# EAGLE design mokkamaster (EAGLE 8.7.0)
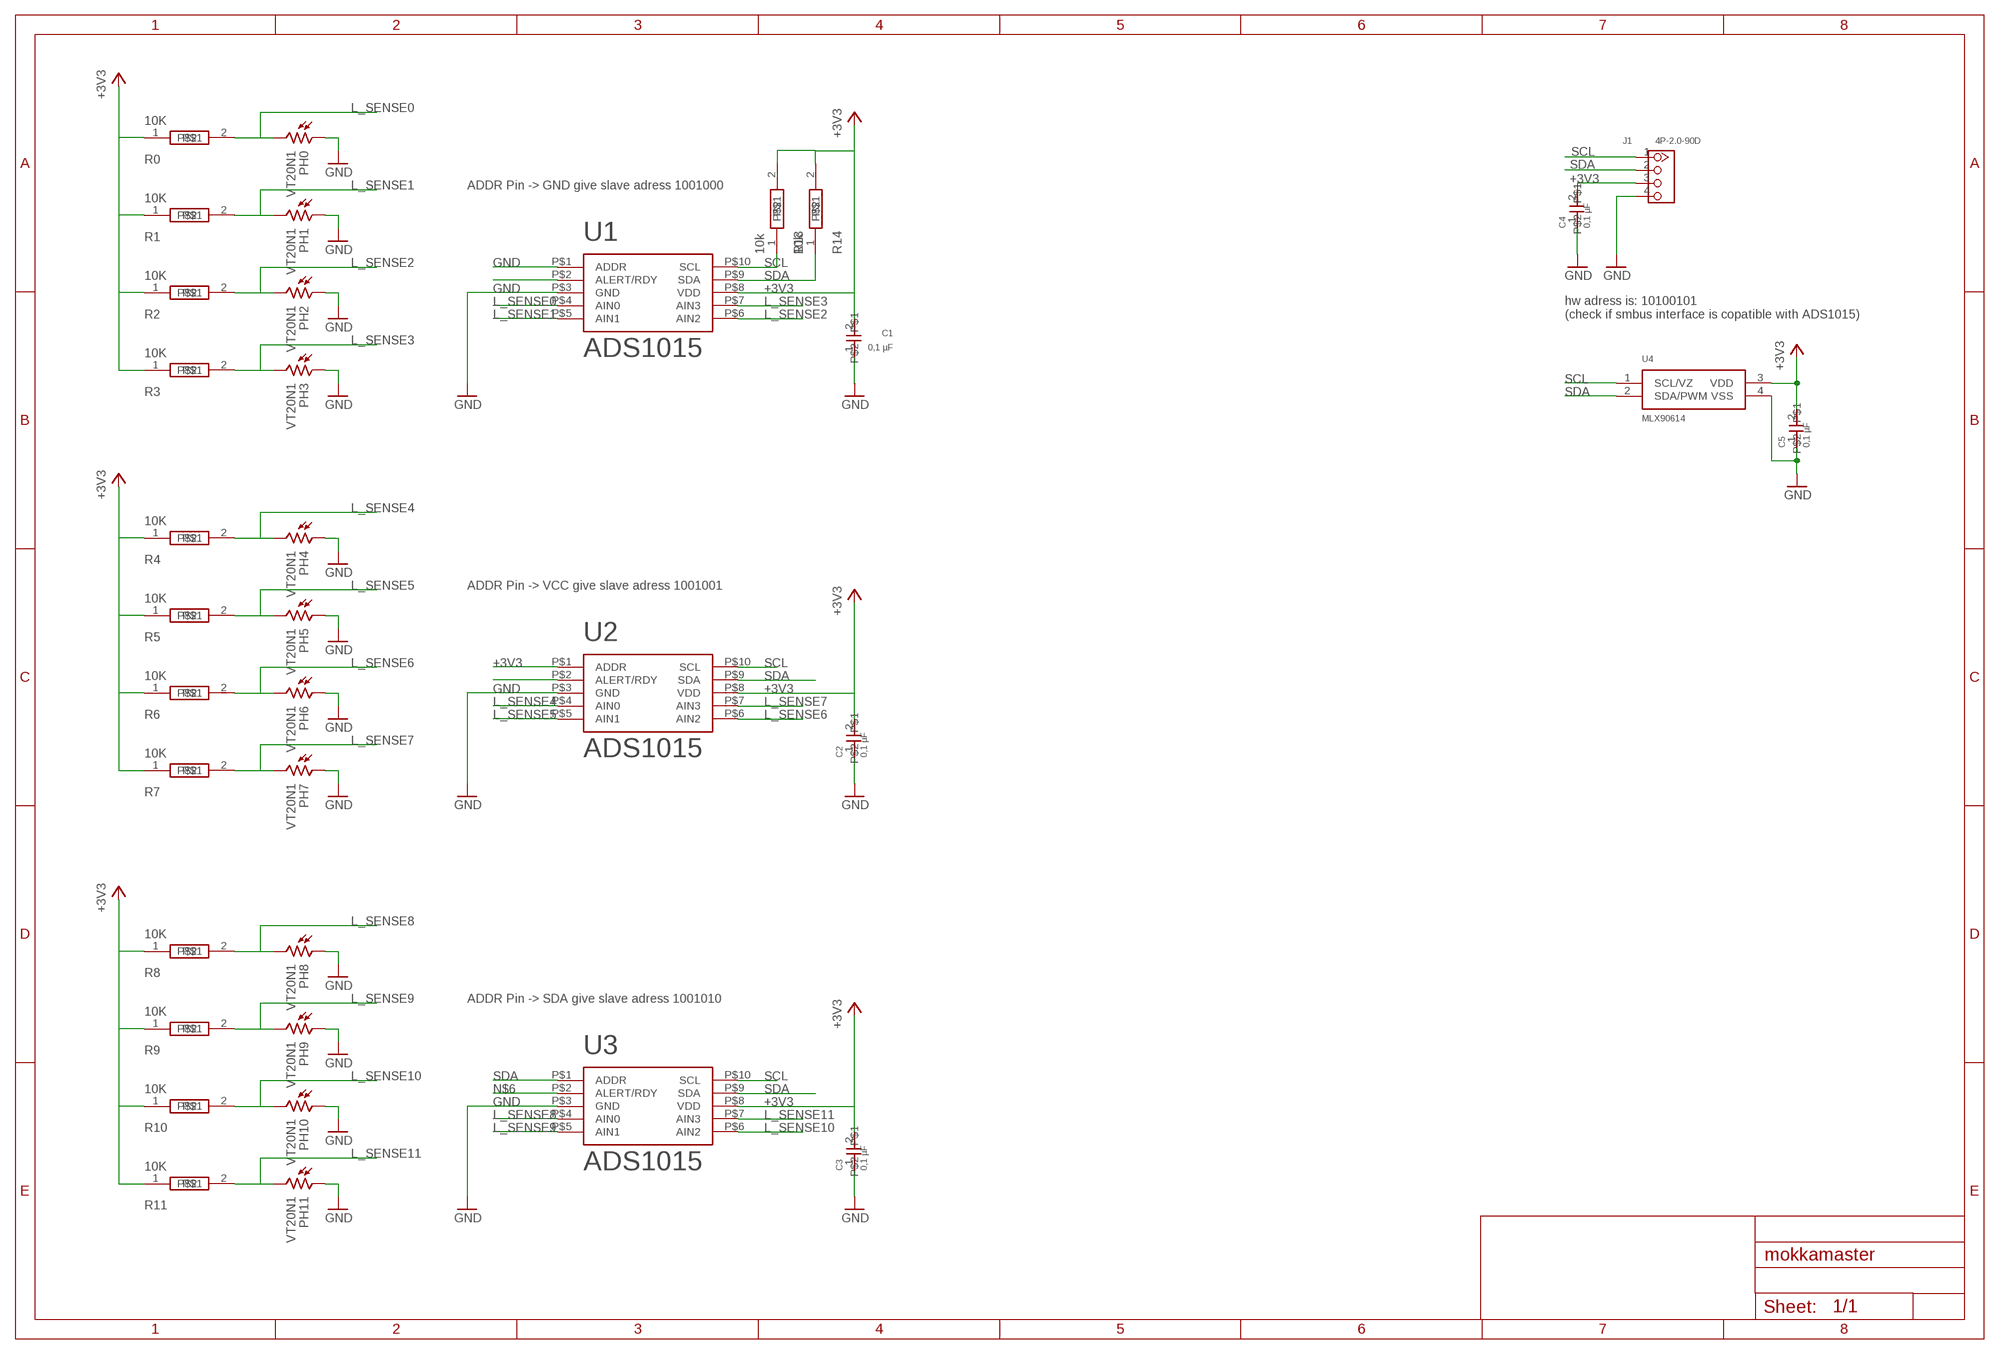
[diagram p0: schematic, sheet 1]

## Parts
C1  0,1 µF  CAPACITOR_GENERIC  [C0603]
C2  0,1 µF  CAPACITOR_GENERIC  [C0603]
C3  0,1 µF  CAPACITOR_GENERIC  [C0603]
C4  0,1 µF  CAPACITOR_GENERIC  [C0603]
C5  0,1 µF  CAPACITOR_GENERIC  [C0603]
J1  4P-2.0-90D  GROVE-CONNECTOR-DIP-90D(4P-2.0)  [HW4-2.0-90D]
PH0  VT20N1  [TO46-VT200]
PH1  VT20N1  [TO46-VT200]
PH2  VT20N1  [TO46-VT200]
PH3  VT20N1  [TO46-VT200]
PH4  VT20N1  [TO46-VT200]
PH5  VT20N1  [TO46-VT200]
PH6  VT20N1  [TO46-VT200]
PH7  VT20N1  [TO46-VT200]
PH8  VT20N1  [TO46-VT200]
PH9  VT20N1  [TO46-VT200]
PH10  VT20N1  [TO46-VT200]
PH11  VT20N1  [TO46-VT200]
R0  10K  RESISTOR_GENERIC  [R0603]
R1  10K  RESISTOR_GENERIC  [R0603]
R2  10K  RESISTOR_GENERIC  [R0603]
R3  10K  RESISTOR_GENERIC  [R0603]
R4  10K  RESISTOR_GENERIC  [R0603]
R5  10K  RESISTOR_GENERIC  [R0603]
R6  10K  RESISTOR_GENERIC  [R0603]
R7  10K  RESISTOR_GENERIC  [R0603]
R8  10K  RESISTOR_GENERIC  [R0603]
R9  10K  RESISTOR_GENERIC  [R0603]
R10  10K  RESISTOR_GENERIC  [R0603]
R11  10K  RESISTOR_GENERIC  [R0603]
R13  10k  RESISTOR_GENERIC  [R0603]
R14  10k  RESISTOR_GENERIC  [R0603]
U1  ADS1015  [PDSO-G10]
U2  ADS1015  [PDSO-G10]
U3  ADS1015  [PDSO-G10]
U4  MLX90614  [SPARKFUN_TO-39]

## Nets
+3V3: C1.2 C2.2 C3.2 C4.2 C5.2 J1.3 R0.1 R1.1 R2.1 R3.1 R4.1 R5.1 R6.1 R7.1 R8.1 R9.1 R10.1 R11.1 R13.2 R14.2 U1.P$8(VDD) U2.P$1(ADDR) U2.P$8(VDD) U3.P$8(VDD) U4.3(VDD)
GND: C1.1 C2.1 C3.1 C4.1 C5.1 J1.4 PH0.1 PH1.1 PH2.1 PH3.1 PH4.1 PH5.1 PH6.1 PH7.1 PH8.1 PH9.1 PH10.1 PH11.1 U1.P$1(ADDR) U1.P$3(GND) U2.P$3(GND) U3.P$3(GND) U4.4(VSS)
L_SENSE0: PH0.2 R0.2 U1.P$4(AIN0)
L_SENSE1: PH1.2 R1.2 U1.P$5(AIN1)
L_SENSE2: PH2.2 R2.2 U1.P$6(AIN2)
L_SENSE3: PH3.2 R3.2 U1.P$7(AIN3)
L_SENSE4: PH4.2 R4.2 U2.P$4(AIN0)
L_SENSE5: PH5.2 R5.2 U2.P$5(AIN1)
L_SENSE6: PH6.2 R6.2 U2.P$6(AIN2)
L_SENSE7: PH7.2 R7.2 U2.P$7(AIN3)
L_SENSE8: PH8.2 R8.2 U3.P$4(AIN0)
L_SENSE9: PH9.2 R9.2 U3.P$5(AIN1)
L_SENSE10: PH10.2 R10.2 U3.P$6(AIN2)
L_SENSE11: PH11.2 R11.2 U3.P$7(AIN3)
N$3: U2.P$2(ALERT/RDY)
N$6: U3.P$2(ALERT/RDY)
N$13: U1.P$2(ALERT/RDY)
SCL: J1.1 R13.1 U1.P$10(SCL) U2.P$10(SCL) U3.P$10(SCL) U4.1(SCL/VZ)
SDA: J1.2 R14.1 U1.P$9(SDA) U2.P$9(SDA) U3.P$1(ADDR) U3.P$9(SDA) U4.2(SDA/PWM)

## Notes on the sheet
- ADDR Pin -> GND give slave adress 1001000
- hw adress is: 10100101
  (check if smbus interface is copatible with ADS1015)
- ADDR Pin -> VCC give slave adress 1001001
- ADDR Pin -> SDA give slave adress 1001010

## Library data of the parts
C1-C5 = commons:CAPACITOR_GENERIC
J1 = Seeed-Connector:GROVE-CONNECTOR-DIP-90D(4P-2.0): 320110034; SPICEPREFIX: X
PH0 PH1-PH11 = commons:VT2*: Photoconductive Cell VT200 Series Source: http://optoelectronics.perkinelmer.com/content/Datasheets/DTS_vt200seriesdatasheet.pdf
R0 R1-R11 R13 R14 = commons:RESISTOR_GENERIC: generic smd resistors
U1-U3 = commons:ADS1015: TI ADS1015 NOT TESTED !! ADS101x Ultra-Small, Low-Power, I 2 C-Compatible, 3.3-kSPS, 12-Bit ADCs With Internal Reference, Oscillator, and Programmable Comparator
U4 = MLX90614:MLX90614

## Board
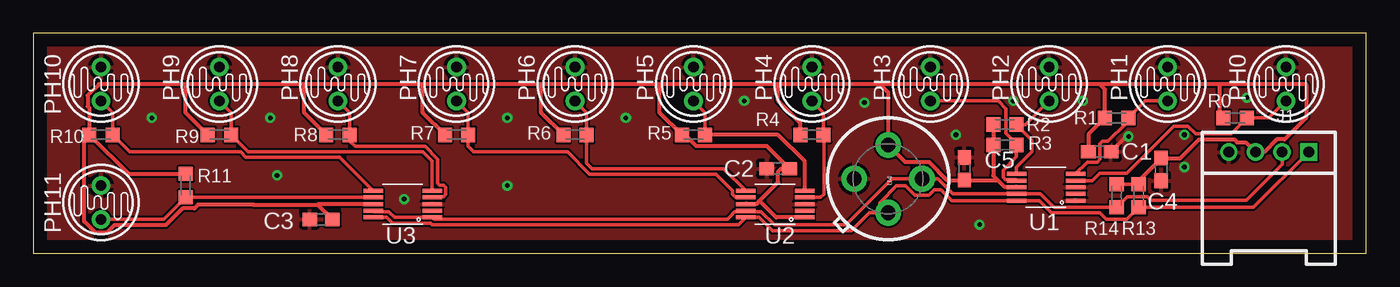
[diagram p1: board, top side]
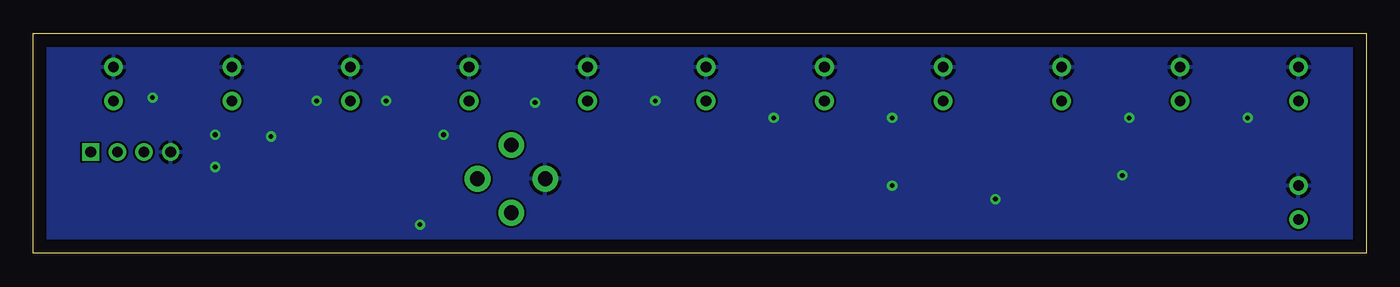
[diagram p2: board, bottom side, seen from below]

Size 100 x 16.5 mm. Coordinates in mm from the lower left corner, seen from the top.
Outline: 0,0 100,0 100,16.5 0,16.5 0,0
Copper layers (1*16): Top 0.035mm / dielectric 1.5mm / Bottom 0.035mm
Design rules "default": minimum track width 6mil, minimum drill 0.35mm, track to track 6mil, track to pad 6mil, pad to pad 6mil, via to via 6mil, smd to smd 6mil, copper to edge 40mil, drill to drill 6mil, minimum pad ring 10mil, minimum via ring 8mil, stop-mask expansion 4mil, vias tented up to drill 0mil, thermal gap 10mil

### Footprints (pad centres in the part's own frame; a part is rotated, then mirrored left to right if it is on the bottom)
C0603 = smd 1.1 x 1: 1 -0.85,0; 2 0.85,0
HW4-2.0-90D = drill 0.8 pad 1.27 square: 1 -3,0 | drill 0.8 pad 1.27: 2 -1,0; 3 1,0; 4 3,0
TO46-VT200 = drill 0.8 pad 1.4: 1 -1.27,0; 2 1.27,0
R0603 = smd 1.05 x 1.08: 1 -0.875,0; 2 0.875,0
PDSO-G10 = smd 0.3 x 1.45: P$1 0.15,-0.727; P$2 0.65,-0.727; P$3 1.15,-0.727; P$4 1.65,-0.727; P$5 2.15,-0.727; P$6 2.15,3.698; P$7 1.65,3.698; P$8 1.15,3.698; P$9 0.65,3.698; P$10 0.15,3.698
SPARKFUN_TO-39 = drill 1.1 pad 1.93: 1 2.54,0; 2 0,2.54; 3 -2.54,0; 4 0,-2.54

### Placement (x,y rotation side)
C1  80.01,7.62 180 top
C2  55.88,6.35 0 top
C3  21.59,2.54 0 top
C4  84.62,6.3 90 top
C5  69.85,6.35 270 top
J1  92.69,7.59 180 top
PH0  93.98,12.7 270 top
PH1  85.09,12.7 270 top
PH2  76.2,12.7 270 top
PH3  67.31,12.7 270 top
PH4  58.42,12.7 270 top
PH5  49.53,12.7 270 top
PH6  40.64,12.7 270 top
PH7  31.75,12.7 270 top
PH8  22.86,12.7 270 top
PH9  13.97,12.7 270 top
PH10  5.08,12.7 270 top
PH11  5.08,3.81 270 top
R0  90.17,10.16 0 top
R1  81.28,10.16 0 top
R2  72.9,9.65 0 top
R3  72.9,8.13 0 top
R4  58.42,8.89 0 top
R5  49.53,8.89 0 top
R6  40.64,8.89 0 top
R7  31.75,8.89 0 top
R8  22.86,8.89 0 top
R9  13.97,8.89 0 top
R10  5.08,8.89 0 top
R11  11.43,5.08 270 top
R13  82.93,4.32 90 top
R14  81.28,4.32 90 top
U1  77.47,3.81 90 top
U2  57.15,2.54 90 top
U3  29.21,2.54 90 top
U4  64.14,5.59 270 top

### Tracks (layer width: path | path; a pad name or v marks a point on that pad's centre or on a via)
+3V3
  Top 0.254: 16.51,3.65 16.68,3.65 | R14.2 R13.2
  Top 0.305: R10.1 7.14,5.96 R11.1 | U2.P$8 53.5,3.73 54.3,3.73 54.49,3.93 | 54.49,3.93 55.88,5.32 55.88,6.12 56.11,6.35 C2.2 55.03,8.04 49.75,8.04 48.91,8.89 R5.1 46.99,10.55 46.99,12.7 | 89,12.7 95.5,12.7 95.5,10.16 93.89,8.55 93.3,8.55 92.34,7.59 J1.3 90.96,8.32 90.32,8.32 90.09,8.55 87.46,8.55 86.06,7.15 C4.2 82.93,5.46 R13.2 | 89,12.7 80.01,12.7 | 80.01,12.7 63.5,12.7 | 63.5,12.7 55.88,12.7 | 55.88,12.7 46.99,12.7 | 46.99,12.7 38.1,12.7 | 38.1,12.7 29.21,12.7 | 29.21,12.7 20.32,12.7 | 20.32,12.7 11.43,12.7 | 80.01,12.7 80.41,12.3 R1.1 79.16,8.91 C1.2 | R4.1 57.55,9.77 55.88,11.43 55.88,12.7 | R6.1 38.1,10.55 38.1,12.7 | R7.1 29.21,10.55 29.21,12.7 | R8.1 20.32,10.55 20.32,12.7 | R9.1 11.43,10.55 11.43,12.7 | 21.34,3.65 16.51,3.65 12.37,3.65 12.1,3.38 11.21,3.38 9.94,2.11 6.07,2.11 5.5,1.53 4.66,1.53 3.81,2.39 3.81,8.49 R10.1 | U3.P$8 21.38,3.69 21.34,3.65 | C3.2 21.34,3.65 | R10.1 4.21,10.88 4.08,11.01 4.08,11.85 4.93,12.7 11.43,12.7 | 63.5,12.7 64.14,12.06 U4.3 65.41,6.86 67.2,6.86 68.56,5.5 C5.2 72.35,5.5 | U1.P$8 73.73,5 72.85,5 72.35,5.5 | R2.1 R3.1 72.02,5.83 72.35,5.5 | U2.P$1 55.73,2.69 54.49,3.93 | R0.1 89,10.46 89,12.7
GND  (via drill 0.35)
  Top 0.305: C1.1 82,8.76 v82.17,8.76
  other vias: 44.45,10.16 91.06,11.68 78.74,11.43 35.56,10.16 8.89,10.16 35.56,5.08 53.34,11.43 17.78,10.16 86.36,6.48 69.22,8.89 18.29,5.84 27.81,4.06 62.36,11.3 73.53,11.43 70.99,2.16 86.36,8.89
  pour Bottom: 0,16.51 100.08,16.51 100.08,0 0,0
  pour Top: 0,16.51 99.95,16.51 99.95,0 0,0
L_SENSE0
  Top 0.254: PH0.2 92.71,10.16 R0.2 89.86,8.98 87.2,8.98 86.63,9.55 85.57,9.55 82.03,6 80,6 79.46,5.46 U1.P$4
L_SENSE1
  Top 0.254: PH1.2 83.42,11.43 R1.2 82.01,10.01 82.01,9.77 80.64,8.4 80.19,8.4 80.03,8.24 80.03,7.04 79.83,6.84 79.08,6.84 U1.P$5
L_SENSE2  (via drill 0.35)
  Top 0.254: U1.P$6 73.77,6.46 74.93,7.62 74.93,8.49 R2.2 74.42,9.65 PH2.2
  other vias: 76.2,11.43
L_SENSE3
  Top 0.254: PH3.2 72.39,11.43 72.97,10.85 72.97,9 73.77,8.19 R3.2 73.66,8.02 73.66,7.62 73.77,7.51 73.77,7.23 72.77,6.23 72.77,5.69 72.93,5.53 73.7,5.53 U1.P$7 73.75,5.44 73.66,5.44
L_SENSE4
  Top 0.254: PH4.2 59.3,10.55 R4.2 59.31,8.88 59.31,4.45 59.05,4.19 U2.P$4
L_SENSE5
  Top 0.254: R5.2 50.41,10.55 PH5.2
  Top 0.305: U2.P$5 57.88,6.89 55.88,8.89 R5.2
L_SENSE6
  Top 0.254: U2.P$6 51.79,6.35 41.91,6.35 41.52,6.75 R6.2 41.52,10.55 PH6.2
L_SENSE7
  Top 0.254: U2.P$7 52.68,4.19 52.45,4.42 52.45,4.7 51.21,5.94 41.74,5.94 40.06,7.62 33.02,7.62 32.62,8.02 R7.2 32.62,10.55 PH7.2
L_SENSE8
  Top 0.254: U3.P$4 30.01,4.26 30.78,4.26 30.94,4.42 30.94,4.96 30.78,5.12 30.48,5.12 30.34,5.26 30.34,7.06 29.38,8.03 24.13,8.03 23.73,8.42 R8.2 23.73,10.55 PH8.2
L_SENSE9
  Top 0.254: U3.P$5 29.94,6.89 29.21,7.62 16.11,7.62 R9.2 14.85,10.55 PH9.2
L_SENSE10
  Top 0.254: U3.P$6 22.99,7.21 15.95,7.21 15.54,7.62 7.22,7.62 R10.2 5.96,10.55 PH10.2
L_SENSE11
  Top 0.254: U3.P$7 25.5,4.21 R11.2 9.77,2.54 PH11.2
SCL
  Top 0.254: U3.P$10 26.52,2.69 26.95,2.26 29.79,2.26 29.92,2.13 52.9,2.13 U2.P$10 54.46,2.69 55.45,1.7 61.39,1.7 62.74,3.05 63.5,3.05 | U4.1 63.5,3.05 | 63.5,3.05 63.5,3.81 64.77,5.08 65.42,5.08 66.16,4.34 67.19,4.34 67.62,4.77 68.1,4.77 68.91,3.96 U1.P$10 75.47,3.96 76.4,3.04 80.02,3.04 80.52,2.54 82.03,2.54 R13.1 91.55,3.44 J1.1
SDA
  Top 0.254: U3.P$9 25.58,3.12 26.66,3.12 27.09,2.69 U3.P$1 30.09,2.54 52.07,2.54 52.45,2.92 52.45,2.96 52.61,3.12 53.38,3.12 U2.P$9 53.52,3.12 54.6,3.12 55.59,2.13 60.96,2.13 64.42,5.59 U4.2 67.86,5.59 68.99,4.46 U1.P$9 75.55,4.46 76.57,3.44 R14.1 82.08,4.25 83.59,4.25 83.83,4 91,4 93.69,6.69 J1.2